# EAGLE schematic BOTTOM_BRD_v1.0.1 (EAGLE 9.6.2)
NYU Shanghai Swarm Robotics 2020
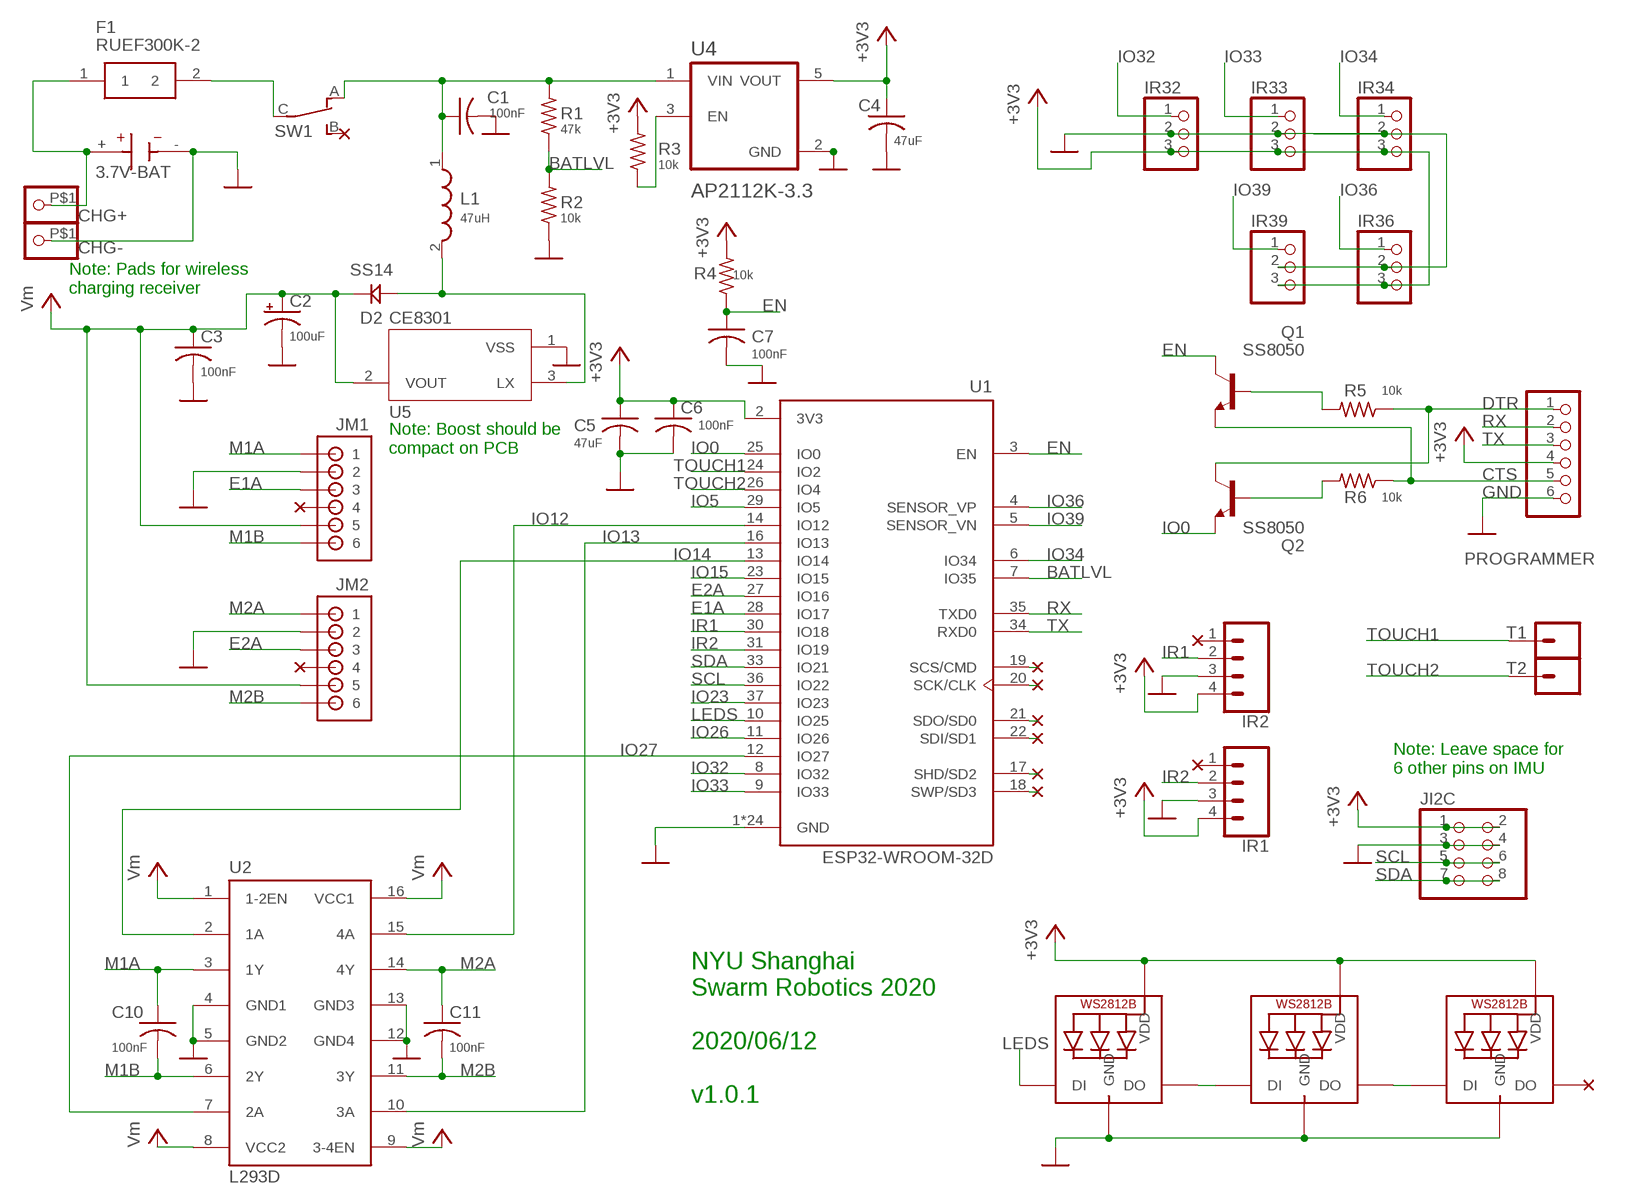
[diagram p0: schematic, sheet 1]

## Parts
BT1  3.7V-BAT  6S-AA  [BAT_6S-AA]
C1  100nF  C-USC0805  [C0805]
C2  100uF  CPOL-US153CLV-0605  [153CLV-0605]
C3  100nF  C-USC0805  [C0805]
C4  47uF  C-USC0805  [C0805]
C5  47uF  C-USC0805  [C0805]
C6  100nF  C-USC0805  [C0805]
C7  100nF  C-USC0805  [C0805]
C10  100nF  C-USC0805  [C0805]
C11  100nF  C-USC0805  [C0805]
CHARGING  WS2812B5050  [WS2812B]
CHG+  PINHD-1X1-BIGPOGO  [1X1-BIGPOGO]
CHG-  PINHD-1X1-BIGPOGO  [1X1-BIGPOGO]
D2  SS14  [DO214]
F1  RUEF300K-2  [RUEF300K2]
IR1  CONN_04  [1X04]
IR2  CONN_04  [1X04]
IR32  PINHD-1X3  [1X03]
IR33  PINHD-1X3  [1X03]
IR34  PINHD-1X3  [1X03]
IR36  PINHD-1X3  [1X03]
IR39  PINHD-1X3  [1X03]
JI2C  PINHD-2X4  [2X04]
JM1  B6B-ZR  [B6B-ZR]
JM2  B6B-ZR  [B6B-ZR]
L1  47uH  SDR0604-100KL  [INDP5858X480N]
POWER  WS2812B5050  [WS2812B]
PROGRAMMER  PINHD-1X6B  [1X06-BIG]
Q1  SS8050  BC850  [SOT23]
Q2  SS8050  BC850  [SOT23]
R1  47k  R-US_M0805  [M0805]
R2  10k  R-US_M0805  [M0805]
R3  10k  R-US_M0805  [M0805]
R4  10k  R-US_M0805  [M0805]
R5  10k  R-US_M0805  [M0805]
R6  10k  R-US_M0805  [M0805]
STATE  WS2812B5050  [WS2812B]
SW1  CS12ANW03  [CS12ANW03]
T1  CONN_01SPRING-CONN  [SPRING-CONNECTOR]
T2  CONN_01SPRING-CONN  [SPRING-CONNECTOR]
U1  ESP32-WROOM-32D  [MODULE_ESP32-WROOM-32D]
U2  L293D  [DIL16]
U4  AP2112K-3.3  AP2112K-3.3TRG1  [SOT95P285X140-5N]
U5  CE8301  MCP1702T-3302E/MB  [REG_MCP1702T-3302E/MB]

## Nets
+3V3: C4.1 C5.1 C6.1 CHARGING.1-VDD(VDD) IR1.4 IR2.4 IR32.3 IR33.3 IR34.3 IR36.3 IR39.3 JI2C.1 JI2C.2 POWER.1-VDD(VDD) PROGRAMMER.4 R3.2 R4.2 STATE.1-VDD(VDD) U1.2(3V3) U4.5(VOUT)
BATLVL: R1.1 R2.2 U1.7(IO35)
CTS: PROGRAMMER.5 Q1.2(E) R6.1
DTR: PROGRAMMER.1 Q2.3(C) R5.1
E1A: JM1.3 U1.28(IO17)
E2A: JM2.3 U1.27(IO16)
EN: C7.1 Q1.3(C) R4.1 U1.3(EN)
GND: BT1.- C1.2 C2.- C3.2 C4.2 C5.2 C6.2 C7.2 CHARGING.3-GND(GND) CHG-.P$1 IR1.3 IR2.3 IR32.2 IR33.2 IR34.2 IR36.2 IR39.2 JI2C.3 JI2C.4 JM1.2 JM2.2 POWER.3-GND(GND) PROGRAMMER.6 R2.1 STATE.3-GND(GND) U1.1(GND) U1.15(GND) U1.38(GND) U1.39_1(GND) U1.39_2(GND) U1.39_3(GND) U1.39_4(GND) U1.39_5(GND) U1.39_6(GND) U1.39_7(GND) U1.39_8(GND) U1.39_9(GND) U1.39_10(GND) U1.39_11(GND) U1.39_12(GND) U1.39_13(GND) U1.39_14(GND) U1.39_15(GND) U1.39_16(GND) U1.39_17(GND) U1.39_18(GND) U1.39_19(GND) U1.39_20(GND) U1.39_21(GND) U2.4(GND1) U2.5(GND2) U2.12(GND4) U2.13(GND3) U4.2(GND) U5.1(VSS)
IO0: Q2.2(E) U1.25(IO0)
IO5: U1.29(IO5)
IO12: U1.14(IO12) U2.15(4A)
IO13: U1.16(IO13) U2.10(3A)
IO14: U1.13(IO14) U2.2(1A)
IO15: U1.23(IO15)
IO23: U1.37(IO23)
IO26: U1.11(IO26)
IO27: U1.12(IO27) U2.7(2A)
IO32: IR32.1 U1.8(IO32)
IO33: IR33.1 U1.9(IO33)
IO34: IR34.1 U1.6(IO34)
IO36: IR36.1 U1.4(SENSOR_VP)
IO39: IR39.1 U1.5(SENSOR_VN)
IR1: IR2.2 U1.30(IO18)
IR2: IR1.2 U1.31(IO19)
LEDS: CHARGING.4-DIN(DI) U1.10(IO25)
M1A: C10.1 JM1.1 U2.3(1Y)
M1B: C10.2 JM1.6 U2.6(2Y)
M2A: C11.1 JM2.1 U2.14(4Y)
M2B: C11.2 JM2.6 U2.11(3Y)
N$1: BT1.+ CHG+.P$1 F1.1
N$2: R3.1 U4.3(EN)
N$3: F1.2 SW1.C
N$4: D2.ANODE L1.2 U5.3(LX)
N$5: U1.19(SCS/CMD)
N$6: C1.1 L1.1 R1.2 SW1.A U4.1(VIN)
N$9: CHARGING.2-DOUT(DO) POWER.4-DIN(DI)
N$12: Q1.1(B) R5.2
N$13: POWER.2-DOUT(DO) STATE.4-DIN(DI)
N$15: Q2.1(B) R6.2
N$16: U1.20(SCK/CLK)
N$18: U1.21(SDO/SD0)
N$23: U1.22(SDI/SD1)
N$24: U1.17(SHD/SD2)
N$25: U1.18(SWP/SD3)
RX: PROGRAMMER.2 U1.35(TXD0)
SCL: JI2C.5 JI2C.6 U1.36(IO22)
SDA: JI2C.7 JI2C.8 U1.33(IO21)
TOUCH1: T1.P$2 U1.24(IO2)
TOUCH2: T2.P$2 U1.26(IO4)
TX: PROGRAMMER.3 U1.34(RXD0)
VCC: C2.+ C3.1 D2.CATHODE(KATHODE) JM1.5 JM2.5 U2.1(1-2EN) U2.8(VCC2) U2.9(3-4EN) U2.16(VCC1) U5.2(VOUT) ; supply symbol labelled Vm
Unconnected: IR1.1 IR2.1 JM1.4 JM2.4 STATE.2-DOUT(DO) SW1.B

## Notes on the sheet
- Note: Pads for wireless 
  charging receiver
- Note: Boost should be
  compact on PCB
- Note: Leave space for 
  6 other pins on IMU
- NYU Shanghai
  Swarm Robotics 2020
  
  2020/06/12
  
  v1.0.1

## Library data of the parts
BT1 = 6S-AA:6S-AA; AVAILABILITY: Unavailable; DESCRIPTION: BATTERY HOLDER AA PC PIN; DIGIKEY-PURCHASE-URL: https://snapeda.com/shop?store=DigiKey&id=4389101; MF: MPD; MP: 6S-AA; PACKAGE: None; PRICE: None
C1 C3-C7 C10 C11 = rcl:C-US: CAPACITOR, American symbol; SPICEPREFIX: C
C2 = rcl:CPOL-US: POLARIZED CAPACITOR, American symbol; SPICEPREFIX: C
CHARGING POWER STATE = adafruit:WS2812B
CHG+ CHG- = adafruit:PINHD-1X1: Pin header 1x1 for 0.1" spacing With round pins
D2 = SS14:SS14; AVAILABILITY: Unavailable; DESCRIPTION: Diode Schottky 40V 1A Surface Mount SMA (DO-214AC); DIGIKEY-PURCHASE-URL: https://snapeda.com/shop?store=DigiKey&id=229686; MF: ON Semiconductor; MP: SS14; PACKAGE: DO-214AC-214 ON Semiconductor; PRICE: None
F1 = RUEF300K-2:RUEF300K-2: TE CONNECTIVITY / RAYCHEM - RUEF300K-2 - RESETTABLE FUSE, PTC, 30V, 3A, RADIAL Source: Datasheet <http://www.farnell.com/datasheets/1482689.pdf>; DESCRIPTION: TE CONNECTIVITY / RAYCHEM - RUEF300K-2 - RESETTABLE FUSE, PTC, 30V, 3A, RADIAL; HEIGHT: 16.5mm; MANUFACTURER_NAME: TE CONNECTIVITY / RAYCHEM; MANUFACTURER_PART_NUMBER: RUEF300K-2
IR1 IR2 = SparkFun-Connectors:CONN_04: Multi connection point. Often used as Generic Header-pin footprint for 0.1 inch spaced/style header connections On any of the 0.1 inch spaced packages, you can populate with these: Break Away Headers - Straight <https://www.sparkfun.com/products/116> (PRT-00116) Break Away Male Headers - Right Angle <https://www.sparkfun.com/products/553> (PRT-00553) Female Headers <https://www.sparkfun.com/products/115> (PRT-00115) Break Away Headers - Machine Pin <https://www.sparkfun.com/products/117> (PRT-00117) Break Away Female Headers - Swiss Machine Pin <https://www.sparkfun.com/products/743> (PRT-00743) For SCREWTERMINALS and SPRING TERMINALS visit here: Screw Terimnals on SparkFun.com <https://www.sparkfun.com/search/results?term=Screw+Terminals> (5mm/3.5mm/2.54mm spacing) This device is also useful as a general connection point to wire up your design to another part of your project. Our various solder wires solder well into these plated through hole pads. Hook-Up Wire - Assortment (Stranded, 22 AWG) <https://www.sparkfun.com/products/11375> (PRT-11375) Hook-Up Wire - Assortment (Solid Core, 22 AWG) <https://www.sparkfun.com/products/11367> (PRT-11367) View the entire wire category on our website here <https://www.sparkfun.com/categories/141> Special notes: Molex polarized connector foot print use with SKU : PRT-08231 with associated crimp pins and housings. 1MM SMD Version SKU: PRT-10208; PROD_ID: CONN-09696
IR32-IR34 IR36 IR39 = adafruit:PINHD-1X3: PIN HEADER
JI2C = adafruit:PINHD-2X4: PIN HEADER
JM1 JM2 = B6B-ZR:B6B-ZR: JST-ZH Connector 6 pol, 1.5mm pitch Package: B6B-ZR Source: http://www.jst-mfg.com/product/pdf/eng/eZH.pdf; AVAILABILITY: Unavailable; DESCRIPTION: Connector Header Surface Mount 6 position 0.059 _1.50mm_; MF: JST; MP: B6B-ZR; PACKAGE: None; PRICE: None
L1 = SDR0604-100KL:SDR0604-100KL: Inductor Power Wirewound 120uH 10% 1KHz 22Q-Factor Ferrite 480mA 930mOhm DCR T/R; AVAILABILITY: Unavailable; DESCRIPTION: 10µH Unshielded Wirewound Inductor Nonstandard; MF: Bourns; MP: SDR0604-100KL; PACKAGE: Nonstandard Bourns; PRICE: None
PROGRAMMER = adafruit:PINHD-1X6: PIN HEADER
Q1 Q2 = transistor:BC850: NPN TRANSISTOR
R1-R6 = rcl:R-US_: RESISTOR, American symbol; SPICEPREFIX: R
SW1 = CS12ANW03:CS12ANW03; AVAILABILITY: Unavailable; DESCRIPTION: Slide Switch SPDT Through Hole; DIGIKEY-PURCHASE-URL: https://snapeda.com/shop?store=DigiKey&id=478299; MF: NKK Switches; MP: CS12ANW03; PACKAGE: None; PRICE: None
T1 T2 = Touch_Pad:CONN_01: Single connection point. Often used as Generic Header-pin footprint for 0.1 inch spaced/style header connections On any of the 0.1 inch spaced packages, you can populate with these: Break Away Headers - Straight <https://www.sparkfun.com/products/116> (PRT-00116) Break Away Male Headers - Right Angle <https://www.sparkfun.com/products/553> (PRT-00553) Female Headers <https://www.sparkfun.com/products/115> (PRT-00115) Break Away Headers - Machine Pin <https://www.sparkfun.com/products/117> (PRT-00117) Break Away Female Headers - Swiss Machine Pin <https://www.sparkfun.com/products/743> (PRT-00743) This device is also useful as a general connection point to wire up your design to another part of your project. Our various solder wires solder well into these plated through hole pads. Hook-Up Wire - Assortment (Stranded, 22 AWG) <https://www.sparkfun.com/products/11375> (PRT-11375) Hook-Up Wire - Assortment (Solid Core, 22 AWG) <https://www.sparkfun.com/products/11367> (PRT-11367) View the entire wire category on our website here <https://www.sparkfun.com/categories/141> Special notes: SMTSO-256-ET is a "flush mount" nut for a 4-40 screw. We mostly use this on specialty testbeds; it is a nice way to connect hardware to your PCB at an adjustable hieght. Also note, the SNAP packages are for using a snappable style connector. We sell a baggie of snaps and they are also used on two LilyPad designs: Snap Assortment - 30 pack (male and female) <https://www.sparkfun.com/products/11347> (DEV-11347) LilyPad Arduino SimpleSnap <https://www.sparkfun.com/products/10941> (DEV-10941) LilyPad SimpleSnap Protoboard <https://www.sparkfun.com/products/10940> (DEV-10940); SF_ID: PRT-11822
U1 = ESP32-WROOM-32D:ESP32-WROOM-32D: Bluetooth, WiFi 802.11b/g/n, Bluetooth v4.2 + EDR, Class 1, 2 and 3 Transceiver Module 2.4GHz ~ 2.5GHz Integrated, Trace Surface Mount; AVAILABILITY: Unavailable; DESCRIPTION: Bluetooth, WiFi 802.11b/g/n, Bluetooth v4.2 +EDR, Class 1, 2 and 3 Transceiver Module 2.4GHz ~ 2.5GHz Integrated, Trace Surface Mount; MF: Espressif Systems; MP: ESP32-WROOM-32D; PACKAGE: Module Espressif Systems; PRICE: None
U2 = st-microelectronics:L293D: PUSH-PULL 4 CHANNEL DRIVER; MPN: L293D; OC_FARNELL: 9589619; OC_NEWARK: 56P8249
U4 = AP2112K-3.3TRG1:AP2112K-3.3TRG1: AP2112 Series 0.6 A 3.3 V Fixed Output SMT LDO Linear Regulator - SOT23-5; AVAILABILITY: Unavailable; DESCRIPTION: Linear Voltage Regulator IC 1 Output 600mA SOT-25; MF: Diodes Inc.; MP: AP2112K-3.3TRG1; PACKAGE: SOT-753 Diodes Inc.; PRICE: None
U5 = MCP1702T-3302E_MB:MCP1702T-3302E/MB: MCP1702 Series 250 mA 3.3 V Fixed Output Surface Mount LDO Regulator - SOT-89; AVAILABILITY: Unavailable; DESCRIPTION: Linear Voltage Regulator IC 1 Output 250mA SOT-89-3; MF: Microchip; MP: MCP1702T-3302E/MB; PACKAGE: SOT-89 Microchip; PRICE: None